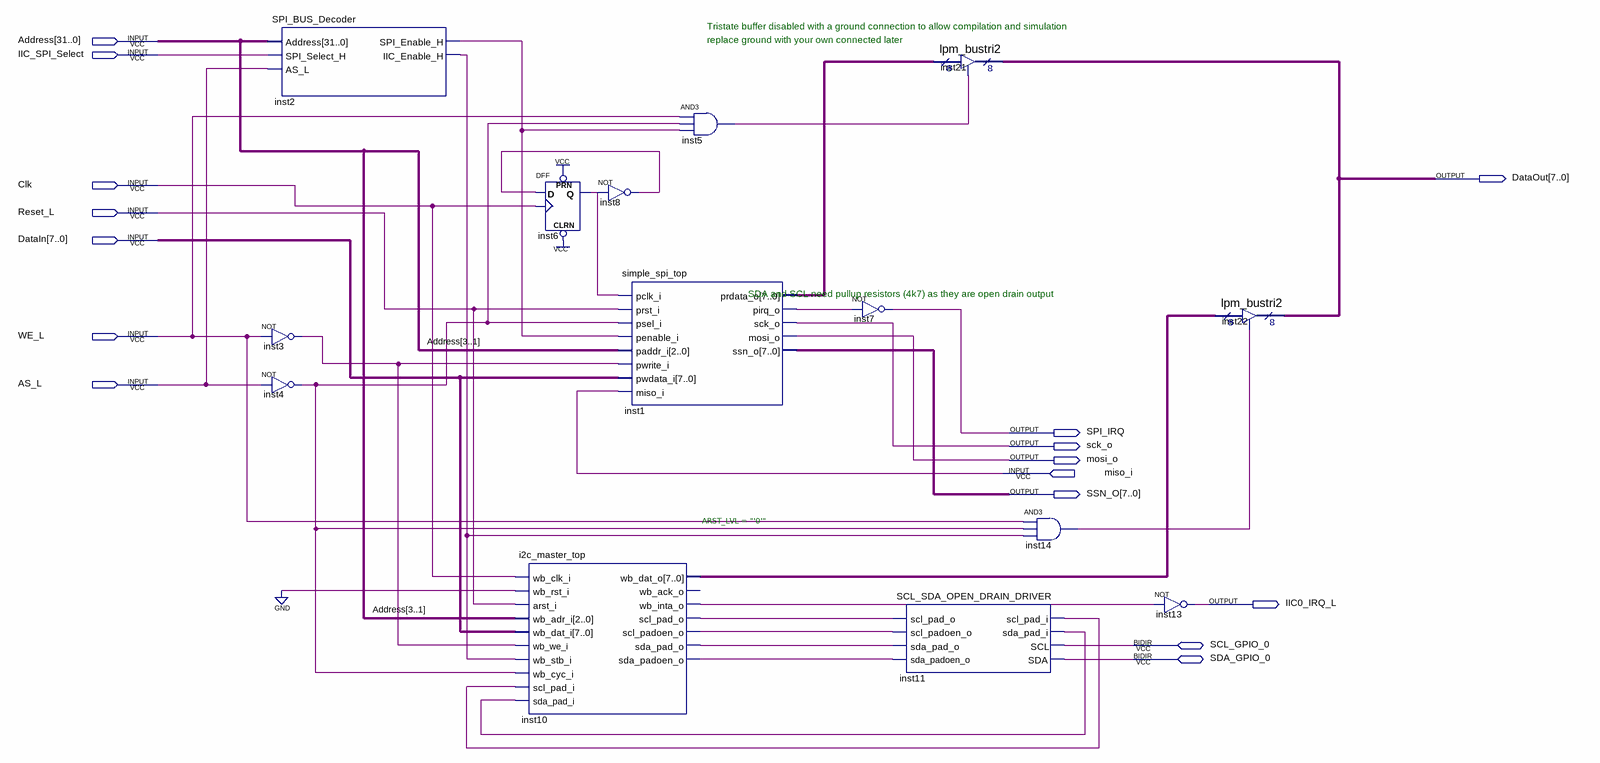
[diagram p0: schematic sheet]
// Quartus schematic IIC_SPI_Interface.bdf as structural Verilog: 14 symbols, 16 pins
module IIC_SPI_Interface (
  input  [31:0] Address,
  input  IIC_SPI_Select,
  input  Clk,
  input  Reset_L,
  input  [7:0] DataIn,
  input  WE_L,
  input  AS_L,
  input  miso_i,
  inout  SCL_GPIO_0,
  inout  SDA_GPIO_0,
  output [7:0] DataOut,
  output SPI_IRQ,
  output sck_o,
  output mosi_o,
  output [7:0] SSN_O,
  output IIC0_IRQ_L
);

  wire inst1_pirq_o, inst2_iic_enable_h, inst2_spi_enable_h, inst3_out, inst4_out, inst5_out, inst6_q,
       inst8_out, inst10_scl_pad_o, inst10_scl_padoen_o, inst10_sda_pad_o, inst10_sda_padoen_o,
       inst10_wb_inta_o, inst11_scl_pad_i, inst11_sda_pad_i, inst14_out;
  wire [7:0] inst1_prdata_o, inst10_wb_dat_o;

  SPI_BUS_Decoder inst2 (
    .Address(Address), .SPI_Select_H(IIC_SPI_Select), .AS_L(AS_L), .SPI_Enable_H(inst2_spi_enable_h),
    .IIC_Enable_H(inst2_iic_enable_h));
  not inst3 (inst3_out, WE_L);
  not inst4 (inst4_out, AS_L);
  i2c_master_top #(.ARST_LVL("'0'")) inst10 (
    .wb_clk_i(Clk), .wb_rst_i(1'b0), .arst_i(Reset_L), .wb_adr_i(Address[3:1]), .wb_dat_i(DataIn),
    .wb_we_i(inst3_out), .wb_stb_i(inst2_iic_enable_h), .wb_cyc_i(inst4_out), .scl_pad_i(inst11_scl_pad_i),
    .sda_pad_i(inst11_sda_pad_i), .wb_dat_o(inst10_wb_dat_o), .wb_inta_o(inst10_wb_inta_o),
    .scl_pad_o(inst10_scl_pad_o), .scl_padoen_o(inst10_scl_padoen_o), .sda_pad_o(inst10_sda_pad_o),
    .sda_padoen_o(inst10_sda_padoen_o));  // open: wb_ack_o
  DFF inst6 (.CLRN(1'b1), .CLK(Clk), .D(inst8_out), .PRN(1'b1), .Q(inst6_q));
  not inst8 (inst8_out, inst6_q);
  simple_spi_top inst1 (
    .pclk_i(inst6_q), .prst_i(Reset_L), .psel_i(inst4_out), .penable_i(inst2_spi_enable_h),
    .paddr_i(Address[3:1]), .pwrite_i(inst3_out), .pwdata_i(DataIn), .miso_i(miso_i),
    .prdata_o(inst1_prdata_o), .pirq_o(inst1_pirq_o), .sck_o(sck_o), .mosi_o(mosi_o), .ssn_o(SSN_O));
  and inst5 (inst5_out, WE_L, inst4_out, inst2_spi_enable_h);
  not inst7 (SPI_IRQ, inst1_pirq_o);
  SCL_SDA_OPEN_DRAIN_DRIVER inst11 (
    .scl_pad_o(inst10_scl_pad_o), .scl_padoen_o(inst10_scl_padoen_o), .sda_pad_o(inst10_sda_pad_o),
    .sda_padoen_o(inst10_sda_padoen_o), .scl_pad_i(inst11_scl_pad_i), .sda_pad_i(inst11_sda_pad_i),
    .SCL(SCL_GPIO_0), .SDA(SDA_GPIO_0));
  lpm_bustri2 inst21 (.enabledt(inst5_out), .data(inst1_prdata_o), .tridata(DataOut));
  and inst14 (inst14_out, WE_L, inst4_out, inst2_iic_enable_h);
  not inst13 (IIC0_IRQ_L, inst10_wb_inta_o);
  lpm_bustri2 inst22 (.enabledt(inst14_out), .data(inst10_wb_dat_o), .tridata(DataOut));

  // Notes on the sheet:
  //   Tristate buffer disabled with a ground connection to allow compilation and simulation
  //   replace ground with your own connected later
  //   SDA and SCL need pullup resistors (4k7) as they are open drain output
endmodule
